# EAGLE design AmbaSat-1-SolarBoard (EAGLE 9.5.1)
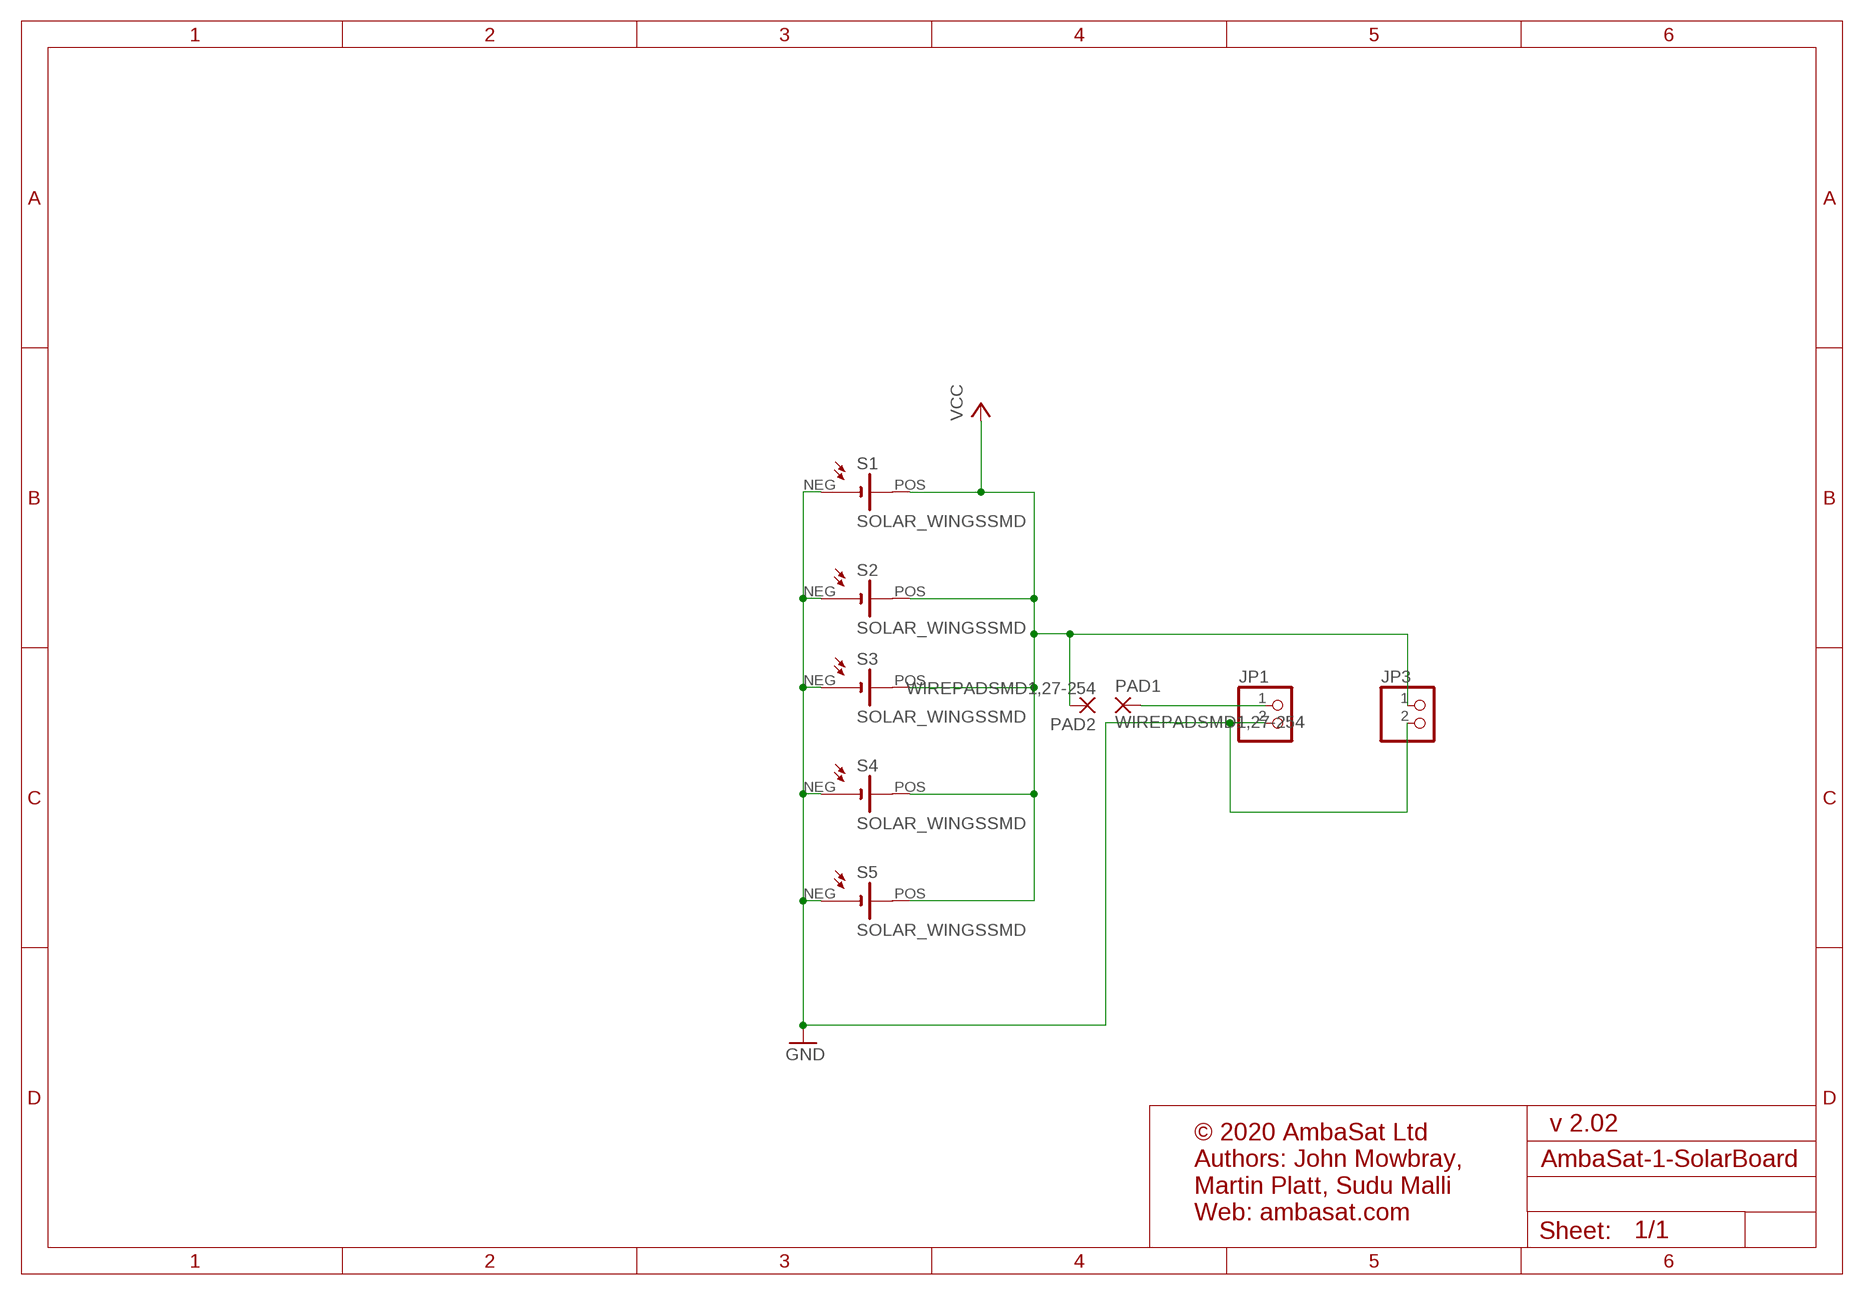
[diagram p0: schematic, sheet 1]

## Parts
JP1  PINHD-1X2  [1X02]
JP3  PINHD-1X2  [1X02]
PAD1  WIREPADSMD1,27-254  [SMD1,27-2,54]
PAD2  WIREPADSMD1,27-254  [SMD1,27-2,54]
S1  SOLAR_WINGSSMD  [SOLAR_WINGS_SMD]
S2  SOLAR_WINGSSMD  [SOLAR_WINGS_SMD]
S3  SOLAR_WINGSSMD  [SOLAR_WINGS_SMD]
S4  SOLAR_WINGSSMD  [SOLAR_WINGS_SMD]
S5  SOLAR_WINGSSMD  [SOLAR_WINGS_SMD]

## Nets
GND: JP1.2 JP3.2 S1.NEG S2.NEG S3.NEG S4.NEG S5.NEG
N$1: JP1.1 PAD1.1(P)
VCC: JP3.1 PAD2.1(P) S1.POS S2.POS S3.POS S4.POS S5.POS

## Notes on the sheet
- v 2.02
- © 2020 AmbaSat Ltd
  Authors: John Mowbray, 
  Martin Platt, Sudu Malli
  Web: ambasat.com

## Library data of the parts
JP1 = 1x2_pin_header_5.08:PINHD-1X2: PIN HEADER 5.08mm pitch pin header 1x2
JP3 = pinhead:PINHD-1X2: PIN HEADER 5.08mm pitch pin header 1x2
PAD1 PAD2 = wirepad:WIREPAD: Wire PAD connect wire on PCB
S1-S5 = trisolx-ks:SOLAR_WINGS: 1 Sun: AM 1.5G -(100 mW/cm2) @ 25ᵒC, Voltage (Open Circuit): 2.62 V, Voltage (Max Power):2.33 V, Current (Max Power):14.6 mA, Power (Max Power): 34 mW, Efficiency: 28%, Temp Coeff. V (Max Power): -6.1 mV/ᵒC

## Board
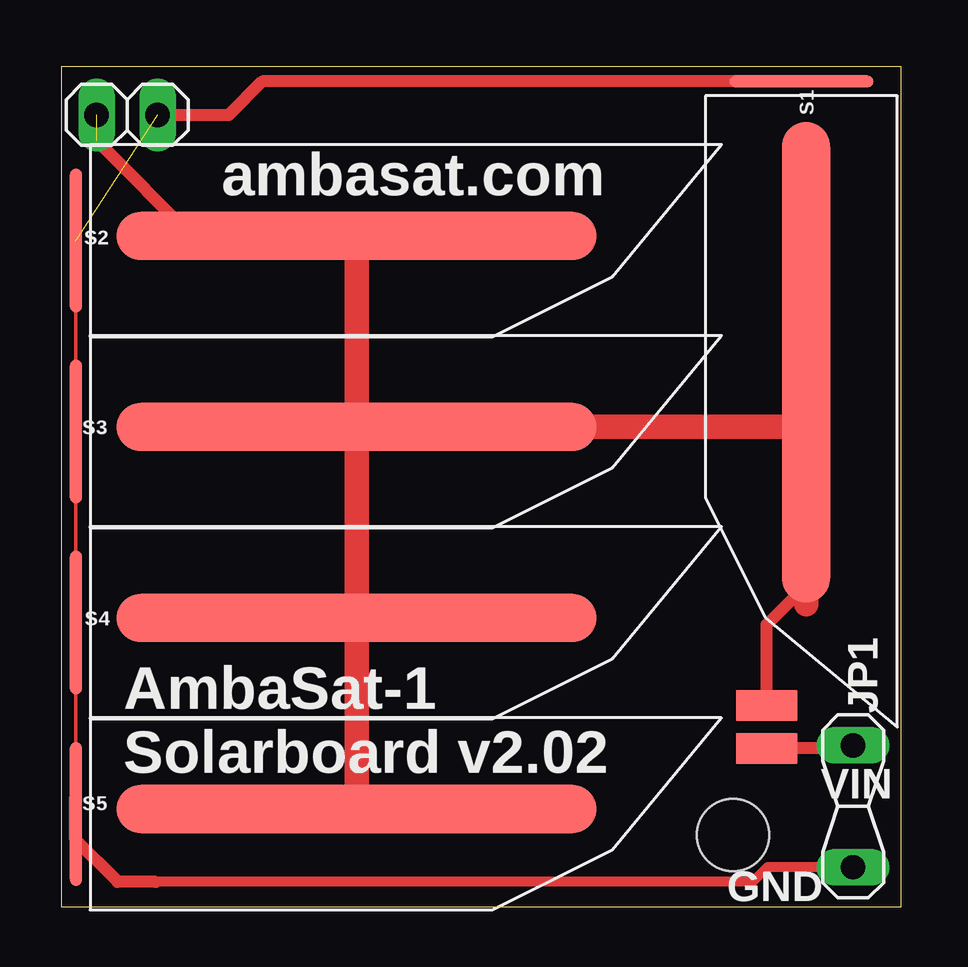
[diagram p1: board, top side]
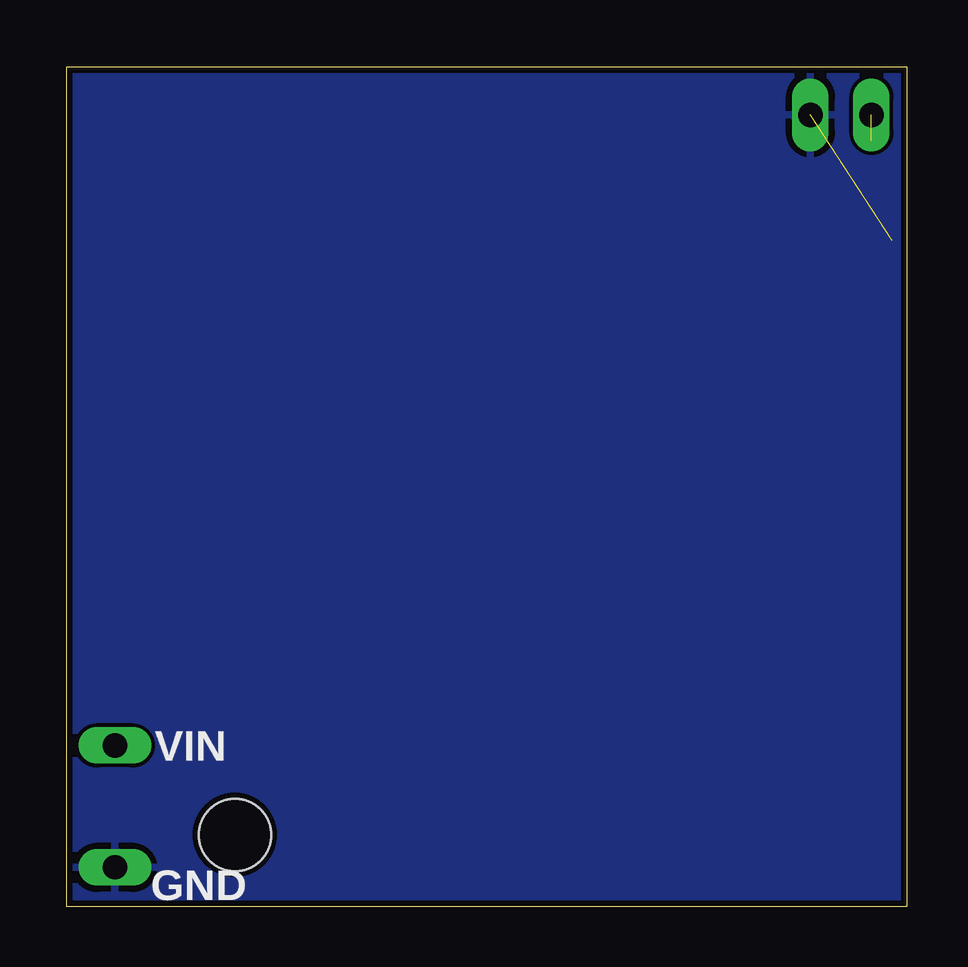
[diagram p2: board, bottom side, seen from below]

Size 35 x 35 mm. Coordinates in mm from the lower left corner, seen from the top.
Outline: 0,0 35,0 35,35 0,35 0,0
Copper layers (1*16): Top 0.035mm / dielectric 1.5mm / Bottom 0.035mm
Design rules "SeeedStudio_2layer_DRU_no_angle_20140221": minimum track width 6mil, minimum drill 12mil, track to track 6mil, track to pad 6mil, pad to pad 6mil, via to via 6mil, smd to smd 0mil, copper to edge 10mil, drill to drill 10mil, minimum pad ring 10mil, minimum via ring 6mil, stop-mask expansion 2mil, vias tented up to drill 100mil, thermal gap 10mil
Holes 3 mm at 28,3

### Footprints (pad centres in the part's own frame; a part is rotated, then mirrored left to right if it is on the bottom)
1X02 = drill 1.016 long: 1 -2.54,0; 2 2.54,0
1X02' = drill 1.016 long: 1 -1.27,0; 2 1.27,0
SMD1,27-2,54 = smd 1.27 x 2.54: 1 0,0
SOLAR_WINGS_SMD = smd 0.5 x 6: NEG 0.6,4 | smd 20 x 2: POS -11.1,3.8

### Placement (x,y rotation side)
JP1  33,4.19 270 top
JP3  [1X02']  2.75,33 0 top
PAD1  29.4,6.6 90 top
PAD2  29.4,8.4 90 top
S1  34.84,33.79 90 top
S2  1.22,31.76 180 top
S3  1.22,23.8 180 top
S4  1.22,15.84 180 top
S5  1.22,7.88 180 top

### Tracks (layer width: path | path; a pad name or v marks a point on that pad's centre or on a via)
GND  (1 unrouted)
  Top 0.152: S5.NEG 0.62,4.6 S4.NEG S3.NEG S2.NEG
  Top 0.406: JP1.2 29.42,1.65 28.81,1.04 3.94,1.04
  Top 0.508: S1.NEG 8.39,34.39 7,33 JP3.2 | 3.94,1.04 2.36,1.04 0.6,2.8 0.6,4.58 0.62,4.6
  pour Bottom: 0,35 0,0 35.07,0 35.07,35
N$1
  Top 0.508: JP1.1 32.87,6.6 PAD1.1
VCC  (1 unrouted)
  Top 0.508: 7.33,27.96 S2.POS 12.16,27.8 5.6,27.8 1.48,31.92 | S1.POS 31.04,13.4 29.4,11.76 PAD2.1
  Top 1.016: S2.POS S3.POS | S3.POS S4.POS S5.POS | 31.04,20.78 S1.POS | S3.POS 31.04,20 31.04,13.4 31.04,12.6

### Text on the board
tPlace: ambasat.com | AmbaSat-1 / Solarboard v2.02 | VIN | GND
bPlace: VIN | GND